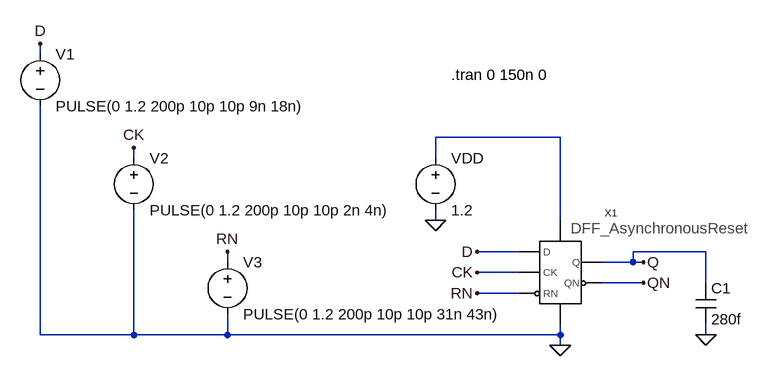
[diagram p0: schematic test.asc]
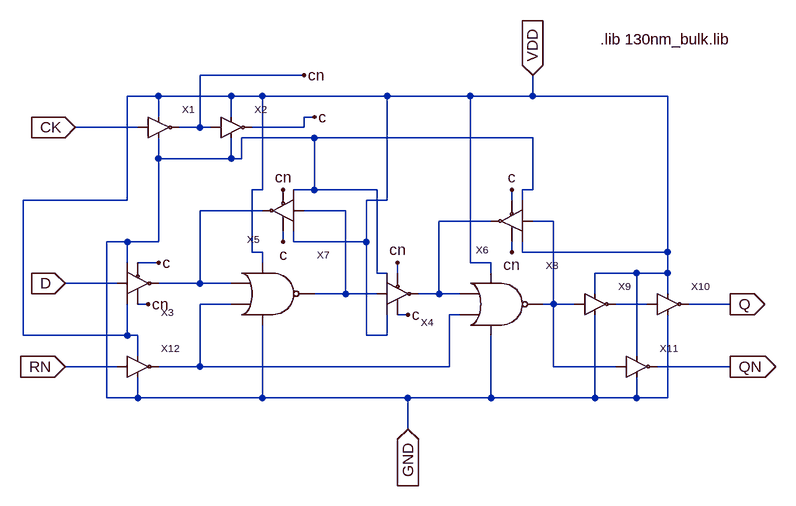
[diagram p1: sub-circuit ffd_rs.asc]
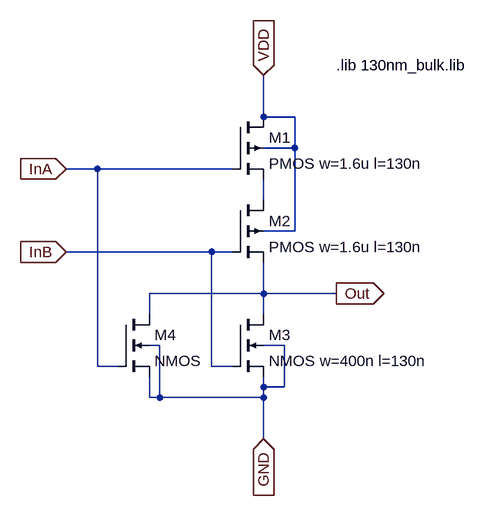
[diagram p2: sub-circuit nor.asc]
test.asc, the LTspice schematic file:
Version 4
SHEET 1 880 680
WIRE -608 -176 -608 -192
WIRE 192 -48 0 -48
WIRE -464 -16 -464 -32
WIRE 0 -16 0 -48
WIRE 0 80 0 64
WIRE 192 80 192 -48
WIRE 128 128 64 128
WIRE 416 128 304 128
WIRE -320 144 -320 128
WIRE 304 144 304 128
WIRE 304 144 256 144
WIRE 320 144 304 144
WIRE 128 160 64 160
WIRE 320 176 256 176
WIRE 416 176 416 128
WIRE 128 192 64 192
WIRE -608 256 -608 -96
WIRE -464 256 -464 64
WIRE -464 256 -608 256
WIRE -320 256 -320 224
WIRE -320 256 -464 256
WIRE 192 256 192 240
WIRE 192 256 -320 256
WIRE 416 256 416 240
WIRE 192 272 192 256
FLAG 192 272 0
FLAG 0 80 0
FLAG -608 -192 D
FLAG 64 128 D
FLAG -464 -32 CK
FLAG 64 160 CK
FLAG -320 128 RN
FLAG 64 192 RN
FLAG 320 144 Q
FLAG 320 176 QN
FLAG 416 256 0
SYMBOL FFD_RS 192 160 R0
SYMATTR InstName X1
SYMBOL voltage -608 -192 R0
WINDOW 123 0 0 Left 0
WINDOW 39 0 0 Left 0
SYMATTR InstName V1
SYMATTR Value PULSE(0 1.2 200p 10p 10p 9n 18n)
SYMBOL voltage -464 -32 R0
WINDOW 123 0 0 Left 0
WINDOW 39 0 0 Left 0
SYMATTR InstName V2
SYMATTR Value PULSE(0 1.2 200p 10p 10p 2n 4n)
SYMBOL voltage -320 128 R0
WINDOW 123 0 0 Left 0
WINDOW 39 0 0 Left 0
SYMATTR InstName V3
SYMATTR Value PULSE(0 1.2 200p 10p 10p 31n 43n)
SYMBOL voltage 0 -32 R0
SYMATTR InstName VDD
SYMATTR Value 1.2
SYMBOL cap 400 176 R0
SYMATTR InstName C1
SYMATTR Value 280f
TEXT 24 -144 Left 2 !.tran 0 150n 0

ffd_rs.asc, the sub-circuit schematic file:
Version 4
SHEET 1 1088 680
WIRE 336 -64 176 -64
WIRE 112 -32 64 -32
WIRE 224 -32 112 -32
WIRE 272 -32 224 -32
WIRE 464 -32 272 -32
WIRE 592 -32 464 -32
WIRE 688 -32 688 -64
WIRE 688 -32 592 -32
WIRE 896 -32 688 -32
WIRE 112 0 112 -32
WIRE 224 0 224 -32
WIRE 352 0 336 0
WIRE 80 16 -16 16
WIRE 176 16 176 -64
WIRE 176 16 144 16
WIRE 192 16 176 16
WIRE 336 16 336 0
WIRE 336 16 256 16
WIRE 352 32 240 32
WIRE 688 32 352 32
WIRE 112 64 112 32
WIRE 224 64 224 32
WIRE 224 64 112 64
WIRE 240 64 240 32
WIRE 240 64 224 64
WIRE 272 112 272 -32
WIRE 272 112 256 112
WIRE 352 112 352 32
WIRE 352 112 320 112
WIRE 448 112 352 112
WIRE 688 112 688 32
WIRE 688 112 672 112
WIRE 64 128 64 -32
WIRE 64 128 -96 128
WIRE 464 128 464 -32
WIRE 464 128 432 128
WIRE 656 128 656 112
WIRE 672 128 672 112
WIRE 272 144 176 144
WIRE 400 144 336 144
WIRE 624 160 544 160
WIRE 720 160 688 160
WIRE 64 192 32 192
WIRE 112 192 112 64
WIRE 112 192 64 192
WIRE 304 192 304 176
WIRE 320 192 320 176
WIRE 432 192 432 128
WIRE 432 192 320 192
WIRE 256 208 256 112
WIRE 272 208 256 208
WIRE 656 208 656 192
WIRE 672 208 672 192
WIRE 896 208 896 -32
WIRE 896 208 672 208
WIRE 64 224 64 192
WIRE 112 224 80 224
WIRE 272 224 272 208
WIRE 592 224 592 -32
WIRE 624 224 592 224
WIRE 448 240 448 112
WIRE 464 240 448 240
WIRE 480 240 480 224
WIRE 624 240 624 224
WIRE 848 240 784 240
WIRE 896 240 896 208
WIRE 896 240 848 240
WIRE 48 256 -32 256
WIRE 176 256 176 144
WIRE 176 256 112 256
WIRE 224 256 176 256
WIRE 400 272 400 144
WIRE 400 272 352 272
WIRE 448 272 400 272
WIRE 544 272 544 160
WIRE 544 272 512 272
WIRE 576 272 544 272
WIRE 784 272 784 240
WIRE 896 272 896 240
WIRE 96 288 80 288
WIRE 224 288 176 288
WIRE 720 288 720 160
WIRE 720 288 704 288
WIRE 752 288 720 288
WIRE 864 288 816 288
WIRE 992 288 928 288
WIRE 496 304 480 304
WIRE 576 304 560 304
WIRE -96 336 -96 128
WIRE 64 336 64 288
WIRE 64 336 -96 336
WIRE 80 336 64 336
WIRE 432 336 432 192
WIRE 464 336 464 304
WIRE 464 336 432 336
WIRE 80 368 80 336
WIRE 848 368 848 240
WIRE 48 384 -32 384
WIRE 176 384 176 288
WIRE 176 384 112 384
WIRE 560 384 560 304
WIRE 560 384 176 384
WIRE 720 384 720 288
WIRE 816 384 720 384
WIRE 992 384 880 384
WIRE 32 432 32 192
WIRE 80 432 80 400
WIRE 80 432 32 432
WIRE 272 432 272 320
WIRE 272 432 80 432
WIRE 496 432 272 432
WIRE 624 432 624 336
WIRE 624 432 496 432
WIRE 784 432 784 304
WIRE 784 432 624 432
WIRE 848 432 848 400
WIRE 848 432 784 432
WIRE 896 432 896 304
WIRE 896 432 848 432
WIRE 496 480 496 432
FLAG -16 16 CK
IOPIN -16 16 In
FLAG -32 384 RN
IOPIN -32 384 In
FLAG -32 256 D
IOPIN -32 256 In
FLAG 992 288 Q
IOPIN 992 288 Out
FLAG 992 384 QN
IOPIN 992 384 Out
FLAG 688 -64 VDD
IOPIN 688 -64 In
FLAG 496 480 GND
IOPIN 496 480 In
FLAG 336 -64 cn
FLAG 352 0 c
FLAG 112 224 c
FLAG 656 112 c
FLAG 96 288 cn
FLAG 656 208 cn
FLAG 480 224 cn
FLAG 304 112 cn
FLAG 304 192 c
FLAG 496 304 c
SYMBOL Tristate_Inv 240 112 R180
SYMATTR InstName X5
SYMBOL Tristate_Inv 592 128 R180
SYMATTR InstName X6
SYMBOL NOR 256 272 R0
SYMATTR InstName X7
SYMBOL NOR 608 288 R0
SYMATTR InstName X8
SYMBOL Inverter 816 304 R0
SYMATTR InstName X9
SYMBOL Inverter 928 304 R0
SYMATTR InstName X10
SYMBOL Inverter 880 400 R0
SYMATTR InstName X11
SYMBOL Inverter 112 400 R0
SYMATTR InstName X12
SYMBOL Tristate_Inv 144 224 M180
SYMATTR InstName X3
SYMBOL Tristate_Inv 544 240 M180
SYMATTR InstName X4
SYMBOL Inverter 144 32 R0
SYMATTR InstName X1
SYMBOL Inverter 256 32 R0
SYMATTR InstName X2
TEXT 792 -120 Left 2 !.lib 130nm_bulk.lib

nor.asc, the sub-circuit schematic file:
Version 4
SHEET 1 880 680
WIRE 240 16 240 -48
WIRE 288 16 240 16
WIRE 288 64 288 16
WIRE 288 64 240 64
WIRE -16 96 -64 96
WIRE 192 96 -16 96
WIRE 240 144 240 112
WIRE 288 192 288 64
WIRE 288 192 240 192
WIRE 160 224 -64 224
WIRE 192 224 160 224
WIRE 240 288 240 240
WIRE 240 288 64 288
WIRE 352 288 240 288
WIRE 64 320 64 288
WIRE 240 320 240 288
WIRE 80 368 64 368
WIRE 272 368 240 368
WIRE -16 400 -16 96
WIRE 16 400 -16 400
WIRE 160 400 160 224
WIRE 192 400 160 400
WIRE 240 432 240 416
WIRE 272 432 272 368
WIRE 272 432 240 432
WIRE 64 448 64 416
WIRE 80 448 80 368
WIRE 80 448 64 448
WIRE 240 448 240 432
WIRE 240 448 80 448
WIRE 240 512 240 448
FLAG -64 96 InA
IOPIN -64 96 In
FLAG -64 224 InB
IOPIN -64 224 In
FLAG 240 -48 VDD
IOPIN 240 -48 In
FLAG 240 512 GND
IOPIN 240 512 In
FLAG 352 288 Out
IOPIN 352 288 Out
SYMBOL pmos4 192 16 R0
SYMATTR InstName M1
SYMATTR Value2 l=130n w=1.6u
SYMATTR Value PMOS w=1.6u l=130n
SYMBOL pmos4 192 144 R0
SYMATTR InstName M2
SYMATTR Value2 l=130n w=1.6u
SYMATTR Value PMOS w=1.6u l=130n
SYMBOL nmos4 192 320 R0
SYMATTR InstName M3
SYMATTR Value2 l=130n w=400n
SYMATTR Value NMOS w=400n l=130n
SYMBOL nmos4 16 320 R0
SYMATTR InstName M4
SYMATTR Value2 l=130n w=400n
TEXT 352 -64 Left 2 !.lib 130nm_bulk.lib

The netlist it stands for:
* test.asc
XX1 D CK RN N001 0 Q QN ffd_rs
V1 D 0 PULSE(0 1.2 200p 10p 10p 9n 18n)
V2 CK 0 PULSE(0 1.2 200p 10p 10p 2n 4n)
V3 RN 0 PULSE(0 1.2 200p 10p 10p 31n 43n)
VDD N001 0 1.2
C1 Q 0 280f

* block symbol definitions
.subckt ffd_rs D CK RN VDD GND Q QN
XX5 N002 VDD GND c cn N001 Tristate_Inv  ; pins In VDD GND EN NEN Out
XX6 N004 VDD GND cn c N003 Tristate_Inv  ; pins In VDD GND EN NEN Out
XX7 N001 N005 VDD GND N002 nor
XX8 N003 N005 VDD GND N004 nor
XX9 N004 VDD GND N006 Inverter  ; pins In VDD GND Out
XX10 N006 VDD GND Q Inverter  ; pins In VDD GND Out
XX11 N004 VDD GND QN Inverter  ; pins In VDD GND Out
XX12 RN VDD GND N005 Inverter  ; pins In VDD GND Out
XX3 D VDD GND cn c N001 Tristate_Inv  ; pins In VDD GND EN NEN Out
XX4 N002 VDD GND c cn N003 Tristate_Inv  ; pins In VDD GND EN NEN Out
XX1 CK VDD GND cn Inverter  ; pins In VDD GND Out
XX2 cn VDD GND c Inverter  ; pins In VDD GND Out
.lib 130nm_bulk.lib
.ends ffd_rs

.subckt nor InA InB VDD GND Out
M1 VDD InA N001 VDD PMOS w=1.6u l=130n l=130n w=1.6u
M2 N001 InB Out VDD PMOS w=1.6u l=130n l=130n w=1.6u
M3 Out InB GND GND NMOS w=400n l=130n l=130n w=400n
M4 Out InA GND GND NMOS l=130n w=400n
.lib 130nm_bulk.lib
.ends nor

.model NMOS NMOS
.model PMOS PMOS
.lib standard.mos
.tran 0 150n 0
.backanno
.end